# Altium schematic sheet Connectors.SchDoc: MoonPilot - Connectors
size A3; DrawnBy: Máni Magnússon; Revision: A; SheetNumber: 6
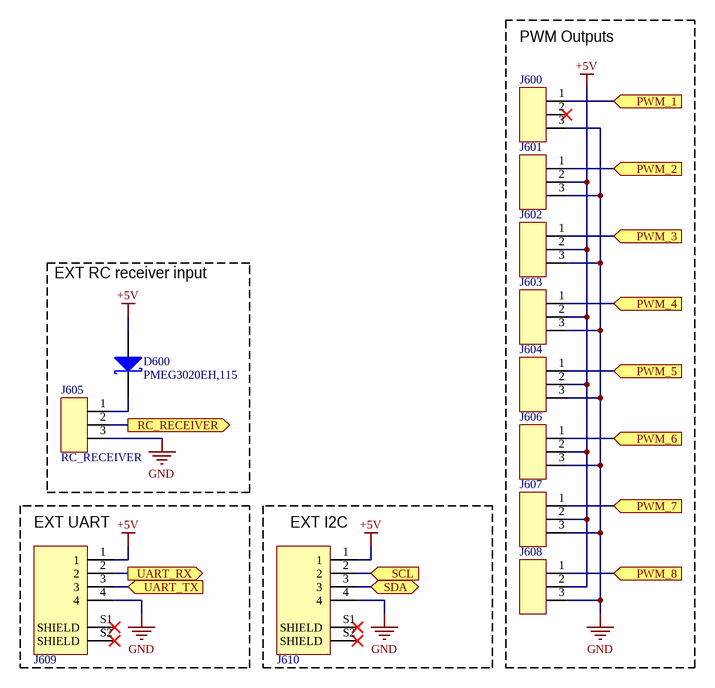
[diagram p0: Connectors.SchDoc]

## Parts
D600  PMEG3020EH,115  [SOD-123]
J600  Generic 3 pin 100 mil header  [HEADER-3-POS_100_mil]  (value not drawn)
J601  Generic 3 pin 100 mil header  [HEADER-3-POS_100_mil]  (value not drawn)
J602  Generic 3 pin 100 mil header  [HEADER-3-POS_100_mil]  (value not drawn)
J603  Generic 3 pin 100 mil header  [HEADER-3-POS_100_mil]  (value not drawn)
J604  Generic 3 pin 100 mil header  [HEADER-3-POS_100_mil]  (value not drawn)
J605  RC_RECEIVER  [HEADER-3-POS_100_mil]
J606  Generic 3 pin 100 mil header  [HEADER-3-POS_100_mil]  (value not drawn)
J607  Generic 3 pin 100 mil header  [HEADER-3-POS_100_mil]  (value not drawn)
J608  Generic 3 pin 100 mil header  [HEADER-3-POS_100_mil]  (value not drawn)
J609  4 pin vertical JST GH  [JST_BM04B-GHS-TBT(LF)(SN)(N)]  (value not drawn)
J610  4 pin vertical JST GH  [JST_BM04B-GHS-TBT(LF)(SN)(N)]  (value not drawn)

## Blocks framed on the sheet
PWM Outputs: J600-J604 J606-J608
EXT RC receiver input: D600 J605
EXT UART: J609
EXT I2C: J610

## Ports
PWM_1 (in), PWM_2 (in), PWM_3 (in), PWM_4 (in), PWM_5 (in), PWM_6 (in), PWM_7 (in), PWM_8 (in), RC_RECEIVER (out), SCL (in), SDA (bidir), UART_RX (out), UART_TX (in)

## Nets
+5V: D600.1(A) J601.2 J602.2 J603.2 J604.2 J606.2 J607.2 J608.2 J609.1 J610.1
GND: J600.3 J601.3 J602.3 J603.3 J604.3 J605.3 J606.3 J607.3 J608.3 J609.4 J610.4
PWM_1: J600.1 ; port PWM_1
PWM_2: J601.1 ; port PWM_2
PWM_3: J602.1 ; port PWM_3
PWM_4: J603.1 ; port PWM_4
PWM_5: J604.1 ; port PWM_5
PWM_6: J606.1 ; port PWM_6
PWM_7: J607.1 ; port PWM_7
PWM_8: J608.1 ; port PWM_8
RC_RECEIVER: J605.2 ; port RC_RECEIVER
SCL: J610.2 ; port SCL
SDA: J610.3 ; port SDA
UART_RX: J609.2 ; port UART_RX
UART_TX: J609.3 ; port UART_TX
NetD600_2: D600.2(K) J605.1

Not connected (* = marked no-connect by the designer): J600 2(*)*; J609 S1(SHIELD)* S2(SHIELD)*; J610 S1(SHIELD)* S2(SHIELD)*

## Notes on the sheet
- Sheet title:
- Revision:
- Drawn by:
- Date:
- File:

## Library data of the parts
D600 = Schottky diode: Digikey part no. 1727-3873-1-ND
J600-J608 = 3 pin 100 mil header
J609 J610 = BM04B-GHS-TBT(LF)(SN)(N): JST GH vertical 4 pin / DigiKey part no. 455-1580-1-ND; MF: JST Sales; MP: BM04B-GHS-TBT_LF__SN__N_; SnapEDA_Link: https://www.snapeda.com/parts/BM04B-GHS-TBT%28LF%29%28SN%29%28N%29/JST%20Sales%20America%20Inc./view-part/841999/?ref=snap; Digi-Key_Part_Number: 455-1580-1-ND; Digi-Key_Purchase_URL: https://www.digikey.com/product-detail/en/jst-sales-america-inc/BM04B-GHS-TBT_LF__SN__N_/455-1580-1-ND/807848?utm_source=snapeda&utm_medium=aggregator&utm_campaign=symbol; Value: *; Package: None